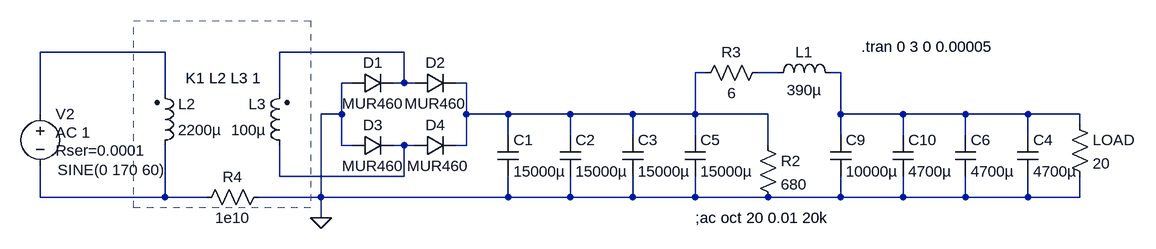
[diagram p0: schematic PS.asc]
PS.asc, the LTspice schematic file:
Version 4
SHEET 1 1416 680
WIRE -544 80 -736 80
WIRE -176 80 -368 80
WIRE 288 112 272 112
WIRE 400 112 368 112
WIRE 496 112 480 112
WIRE -256 128 -272 128
WIRE -176 128 -176 80
WIRE -176 128 -192 128
WIRE -160 128 -176 128
WIRE -80 128 -96 128
WIRE -544 144 -544 80
WIRE -368 144 -368 80
WIRE -736 176 -736 80
WIRE -272 176 -272 128
WIRE -272 176 -304 176
WIRE -80 176 -80 128
WIRE -16 176 -80 176
WIRE 80 176 -16 176
WIRE 176 176 80 176
WIRE 272 176 272 112
WIRE 272 176 176 176
WIRE 384 176 272 176
WIRE 496 176 496 112
WIRE 592 176 496 176
WIRE 688 176 592 176
WIRE 784 176 688 176
WIRE 864 176 784 176
WIRE 864 192 864 176
WIRE -16 208 -16 176
WIRE 80 208 80 176
WIRE 176 208 176 176
WIRE 272 208 272 176
WIRE 496 208 496 176
WIRE 592 208 592 176
WIRE 688 208 688 176
WIRE 784 208 784 176
WIRE -272 224 -272 176
WIRE -256 224 -272 224
WIRE -176 224 -192 224
WIRE -160 224 -176 224
WIRE -80 224 -80 176
WIRE -80 224 -96 224
WIRE 384 224 384 176
WIRE -368 272 -368 224
WIRE -176 272 -176 224
WIRE -176 272 -368 272
WIRE -736 304 -736 256
WIRE -544 304 -544 224
WIRE -544 304 -736 304
WIRE -480 304 -544 304
WIRE -304 304 -304 176
WIRE -304 304 -400 304
WIRE -16 304 -16 272
WIRE -16 304 -304 304
WIRE 80 304 80 272
WIRE 80 304 -16 304
WIRE 176 304 176 272
WIRE 176 304 80 304
WIRE 272 304 272 272
WIRE 272 304 176 304
WIRE 384 304 272 304
WIRE 496 304 496 272
WIRE 496 304 384 304
WIRE 592 304 592 272
WIRE 592 304 496 304
WIRE 688 304 688 272
WIRE 688 304 592 304
WIRE 784 304 784 272
WIRE 784 304 688 304
WIRE 864 304 864 272
WIRE 864 304 784 304
WIRE -304 336 -304 304
FLAG -304 336 0
SYMBOL voltage -736 160 R0
WINDOW 3 27 102 Left 2
WINDOW 123 24 44 Left 2
WINDOW 39 24 72 Left 2
SYMATTR Value SINE(0 170 60)
SYMATTR Value2 AC 1
SYMATTR SpiceLine Rser=0.0001
SYMATTR InstName V2
SYMBOL diode -256 144 R270
WINDOW 3 0 32 VBottom 2
WINDOW 0 32 32 VTop 2
SYMATTR Value MUR460
SYMATTR InstName D1
SYMBOL diode -160 144 R270
WINDOW 0 32 32 VTop 2
WINDOW 3 0 32 VBottom 2
SYMATTR InstName D2
SYMATTR Value MUR460
SYMBOL ind 384 128 R270
WINDOW 0 32 56 VTop 2
WINDOW 3 5 56 VBottom 2
SYMATTR InstName L1
SYMATTR Value 390µ
SYMATTR SpiceLine Rser=72m
SYMBOL diode -256 240 R270
WINDOW 0 32 32 VTop 2
WINDOW 3 0 32 VBottom 2
SYMATTR InstName D3
SYMATTR Value MUR460
SYMBOL diode -160 240 R270
WINDOW 0 32 32 VTop 2
WINDOW 3 0 36 VBottom 2
SYMATTR InstName D4
SYMATTR Value MUR460
SYMBOL cap 64 208 R0
SYMATTR InstName C2
SYMATTR Value 15000µ
SYMATTR SpiceLine Rser=31m
SYMBOL cap -32 208 R0
SYMATTR InstName C1
SYMATTR Value 15000µ
SYMATTR SpiceLine Rser=31m
SYMBOL cap 672 208 R0
SYMATTR InstName C6
SYMATTR Value 4700µ
SYMATTR SpiceLine Rser=71m
SYMBOL cap 256 208 R0
SYMATTR InstName C5
SYMATTR Value 15000µ
SYMATTR SpiceLine Rser=31m
SYMBOL ind2 -560 240 M180
WINDOW 0 36 80 Left 2
WINDOW 3 36 40 Left 2
SYMATTR InstName L2
SYMATTR Value 2200µ
SYMATTR Type ind
SYMBOL ind2 -352 240 R180
WINDOW 0 36 80 Left 2
WINDOW 3 36 40 Left 2
SYMATTR InstName L3
SYMATTR Value 100µ
SYMATTR Type ind
SYMBOL res 848 176 R0
SYMATTR InstName LOAD
SYMATTR Value 20
SYMBOL res 368 208 R0
SYMATTR InstName R2
SYMATTR Value 680
SYMBOL cap 576 208 R0
SYMATTR InstName C10
SYMATTR Value 4700µ
SYMATTR SpiceLine Rser=71m
SYMBOL cap 160 208 R0
SYMATTR InstName C3
SYMATTR Value 15000µ
SYMATTR SpiceLine Rser=31m
SYMBOL res 272 128 R270
WINDOW 0 32 56 VTop 2
WINDOW 3 0 56 VBottom 2
SYMATTR InstName R3
SYMATTR Value 6
SYMBOL cap 480 208 R0
SYMATTR InstName C9
SYMATTR Value 10000µ
SYMATTR SpiceLine Rser=48m
SYMBOL res -384 288 R90
WINDOW 0 0 56 VBottom 2
WINDOW 3 32 56 VTop 2
SYMATTR InstName R4
SYMATTR Value 1e10
SYMBOL cap 768 208 R0
SYMATTR InstName C4
SYMATTR Value 4700µ
SYMATTR SpiceLine Rser=71m
TEXT 272 336 Left 2 !;ac oct 20 0.01 20k
TEXT -512 120 Left 2 !K1 L2 L3 1
TEXT 528 72 Left 2 !.tran 0 3 0 0.00005
RECTANGLE Normal -320 320 -592 32 2

The netlist it stands for:
* PS.asc
V2 N001 N007 SINE(0 170 60) AC 1 Rser=0.0001
D1 0 N002 MUR460
D2 N002 N003 MUR460
L1 N004 N005 390µ Rser=72m
D3 0 N006 MUR460
D4 N006 N003 MUR460
C2 N003 0 15000µ Rser=31m
C1 N003 0 15000µ Rser=31m
C6 N005 0 4700µ Rser=71m
C5 N003 0 15000µ Rser=31m
L2 N007 N001 2200µ
L3 N006 N002 100µ
R§LOAD N005 0 20
R2 N003 0 680
C10 N005 0 4700µ Rser=71m
C3 N003 0 15000µ Rser=31m
R3 N003 N004 6
C9 N005 0 10000µ Rser=48m
R4 0 N007 1e10
C4 N005 0 4700µ Rser=71m
.model D D
.lib standard.dio
;ac oct 20 0.01 20k
K1 L2 L3 1
.tran 0 3 0 0.00005
.backanno
.end